# EAGLE design spider_mx8 (EAGLE 6.5.0)
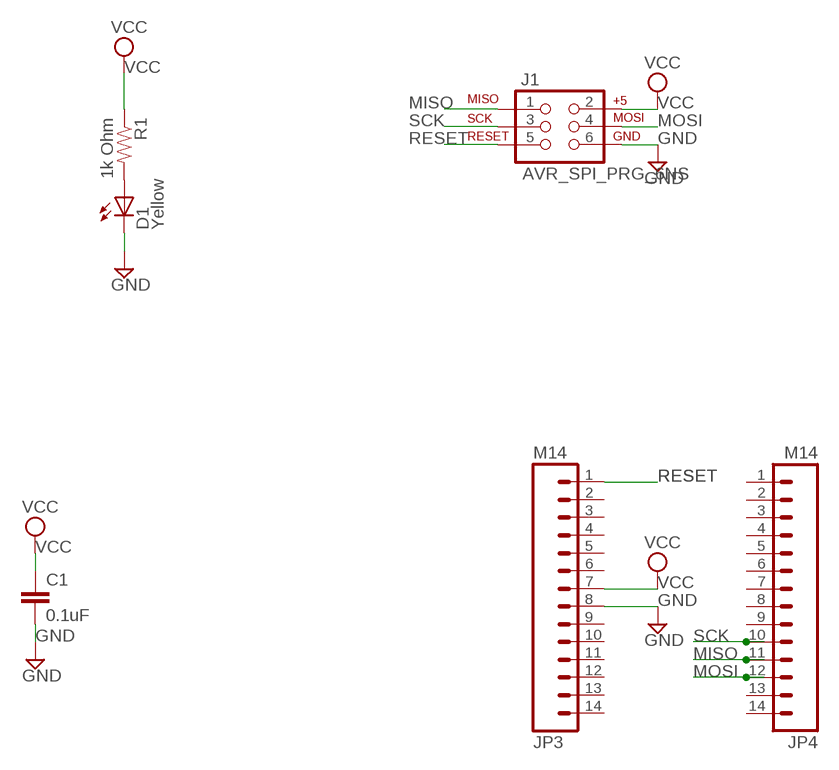
[diagram p0: schematic, sheet 1]

## Parts
C1  0.1uF  CAP1206  [1206]
D1  Yellow  LED-YELLOWLILYPAD  [LED-1206]
J1  AVR_SPI_PRG_6NS  [2X3-NS]
JP3  M14  [1X14]
JP4  M14  [1X14]
R1  1k Ohm  RESISTOR1206  [1206]

## Nets
GND: C1.2 D1.C J1.6 JP3.8
MISO: J1.1 JP4.11
MOSI: J1.4 JP4.12
N$14: D1.A R1.2
RESET: J1.5 JP3.1
SCK: J1.3 JP4.10
VCC: C1.1 J1.2 JP3.7 R1.1
Unconnected: JP3.2 JP3.3 JP3.4 JP3.5 JP3.6 JP3.9 JP3.10 JP3.11 JP3.12 JP3.13 JP3.14 JP4.1 JP4.2 JP4.3 JP4.4 JP4.5 JP4.6 JP4.7 JP4.8 JP4.9 JP4.13 JP4.14

## Library data of the parts
C1 = SparkFun-Passives:CAP: Capacitor Standard 0603 ceramic capacitor, and 0.1" leaded capacitor.
D1 = SparkFun-LED:LED-YELLOW: Yellow SMD LEDs LilyPad 1206- DIO-09909 0603- DIO-09003; PROD_ID: DIO-09909
J1 = SparkFun-Connectors:AVR_SPI_PRG_6: AVR ISP 6 Pin This is the reduced ISP connector for AVR programming. Common on Arduino. This footprint will take up less PCB space and can be used with a 10-pin to 6-pin adapter such as SKU: BOB-08508
JP3 JP4 = SparkFun-Connectors:M14: Header 14 Standard 14-pin 0.1" header. Use with straight break away headers (SKU : PRT-00116), right angle break away headers (PRT-00553), swiss pins (PRT-00743), machine pins (PRT-00117), and female headers (PRT-00115).
R1 = SparkFun-Passives:RESISTOR: Resistor Basic schematic elements and footprints for 0603, 1206, and PTH resistors.

## Board
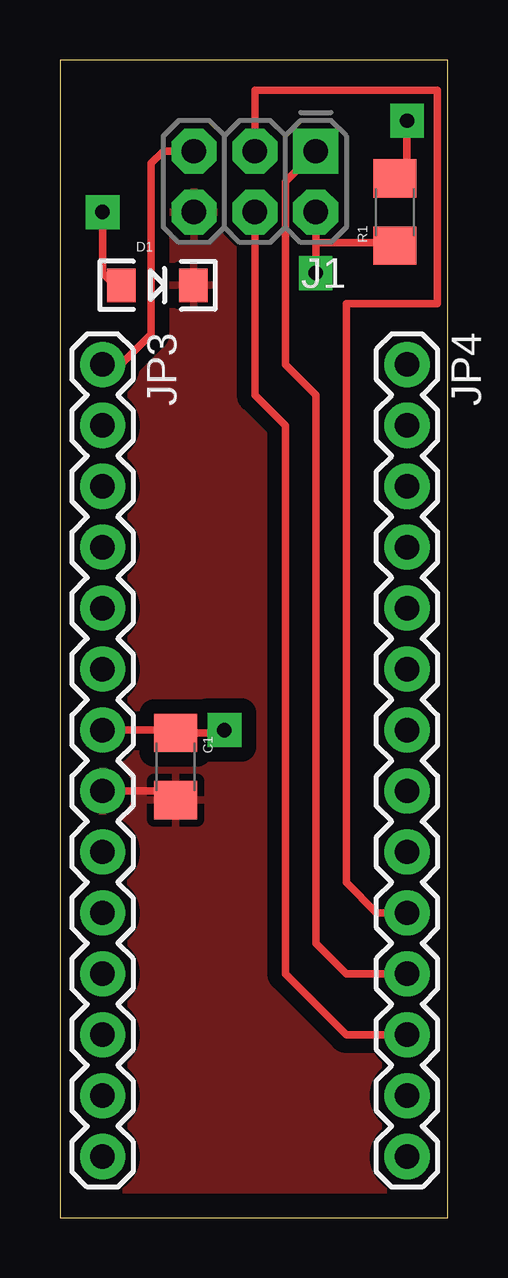
[diagram p1: board, top side]
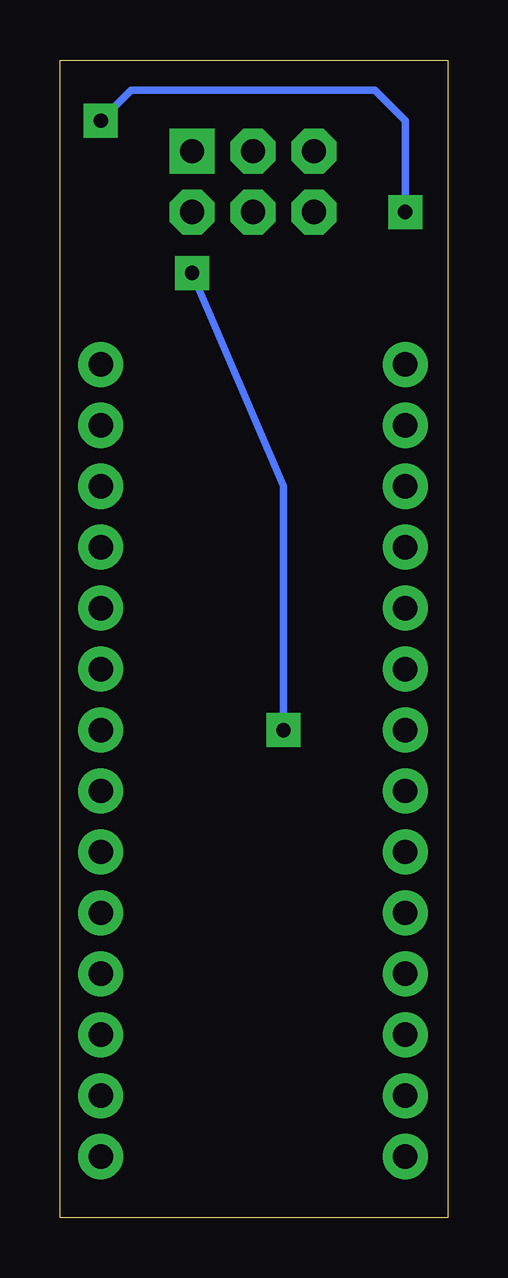
[diagram p2: board, bottom side, seen from below]

Size 16.18 x 48.25 mm. Coordinates in mm from the lower left corner, seen from the top.
Outline: 0,0 16.18,0 16.18,48.25 0,48.25 0,0
Copper layers (1*16): Top 0.035mm / dielectric 1.5mm / Bottom 0.035mm
Design rules "improved_12mil *": minimum track width 12mil, minimum drill 0.8mm, track to track 8mil, track to pad 8mil, pad to pad 8mil, via to via 8mil, smd to smd 8mil, copper to edge 40mil, drill to drill 12mil, minimum pad ring 16mil, minimum via ring 16mil, stop-mask expansion 4mil, vias tented up to drill 0mil, thermal gap 12mil

### Footprints (pad centres in the part's own frame; a part is rotated, then mirrored left to right if it is on the bottom)
1206 = smd 1.6 x 1.8: 1 -1.4,0; 2 1.4,0
LED-1206 = smd 1.2 x 1.4: A -1.5,0; C 1.5,0
2X3-NS = drill 1.016 pad 1.88 square: 1 -2.54,-1.27 | drill 1.016 pad 1.88 octagon: 2 -2.54,1.27; 3 0,-1.27; 4 0,1.27; 5 2.54,-1.27; 6 2.54,1.27
1X14 = drill 1.016 pad 1.88: 1 0,0; 2 2.54,0; 3 5.08,0; 4 7.62,0; 5 10.16,0; 6 12.7,0; 7 15.24,0; 8 17.78,0; 9 20.32,0; 10 22.86,0; 11 25.4,0; 12 27.94,0; 13 30.48,0; 14 33.02,0

### Placement (x,y rotation side)
C1  4.83,18.8 270 top
D1  4.06,38.86 0 top
J1  8.13,43.18 180 top
JP3  1.78,35.56 270 top
JP4  14.48,35.56 270 top
R1  13.97,41.91 90 top

### Tracks (layer width: path | path; a pad name or v marks a point on that pad's centre or on a via)
GND
  Top 0.305: C1.2 4.44,17.78 JP3.8
  pour Top (isolate 0.61): -0.76,48.26 -0.76,-1.27 17.02,-1.27 17.02,48.26
MISO
  Top 0.305: JP4.11 11.94,10.16 10.67,11.43 10.67,34.29 9.4,35.56 9.4,43.18 J1.1
MOSI
  Top 0.305: JP4.12 11.94,7.62 9.4,10.16 9.4,33.02 8.13,34.29 J1.4
N$14  (via drill 0.6)
  Top 0.305: R1.2 14.48,43.82 v14.48,45.72 | v1.78,41.91 1.78,39.37 2.29,38.86 D1.A
  Bottom 0.305: v14.48,45.72 13.21,46.99 3.05,46.99 1.78,45.72 v1.78,41.91
RESET
  Top 0.305: J1.5 4.32,44.45 3.81,43.94 3.81,36.83 2.54,35.56 JP3.1
SCK
  Top 0.305: J1.3 8.13,46.99 15.75,46.99 15.75,38.1 11.94,38.1 11.94,13.97 13.21,12.7 JP4.10
VCC  (via drill 0.6)
  Top 0.305: J1.2 10.67,40.64 | 10.67,40.64 v10.67,39.37 | v6.86,20.32 6.73,20.2 C1.1 4.7,20.32 JP3.7 | 10.67,40.64 13.97,40.64 R1.1
  Bottom 0.305: v10.67,39.37 6.86,30.48 v6.86,20.32